# Altium schematic sheet 1_top.SchDoc: =ProjectTitle
size A4; Engineer: 4pplet; Address1: github.com/4pplet/aekiso60; Address2: Licence: CERN-OHL-S; SheetNumber: 1; SheetTotal: 4; ProjectName: waffling60
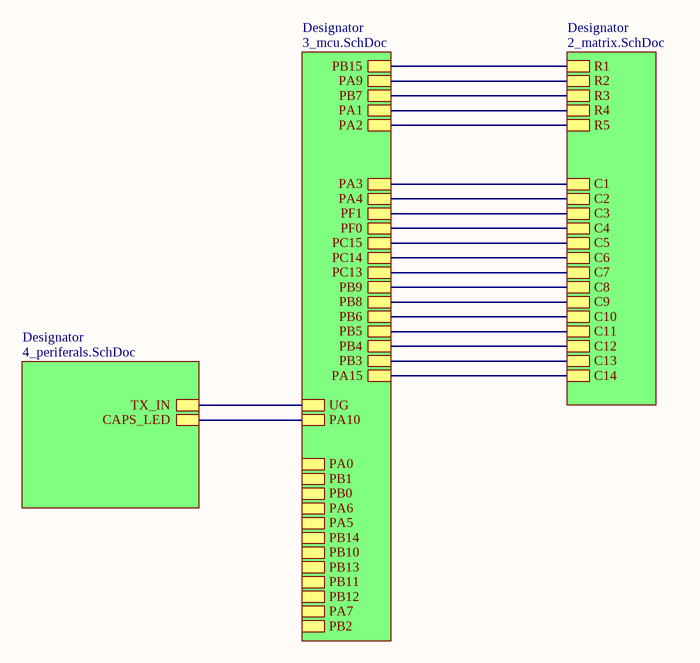
[diagram p0: 1_top.SchDoc]

## Sub-sheets
Designator = 3_mcu.SchDoc: PB8, PA3, PA4, PB11, PB12, PB15, PB13, PB3, PB0, PA9, PA5, PA2, PB7, PB9, PB10, PC14, PA0, PB6, PB2, PB1, PB4, PC15, PA10, PC13, PB14, PA7, PA1, PA6, PA15, PB5, PF1, PF0, UG
Designator = 2_matrix.SchDoc: R5, R4, R3, C1, R1, C2, C14, R2, C12, C3, C4, C5, C6, C7, C8, C9, C10, C11, C13
Designator = 4_periferals.SchDoc: TX_IN, CAPS_LED

## Nets
(unnamed): sheet Designator/PB8, sheet Designator/C9
(unnamed): sheet Designator/PA3, sheet Designator/C1
(unnamed): sheet Designator/PA4, sheet Designator/C2
(unnamed): sheet Designator/PB15, sheet Designator/R1
(unnamed): sheet Designator/PB3, sheet Designator/C13
(unnamed): sheet Designator/PA9, sheet Designator/R2
(unnamed): sheet Designator/PA2, sheet Designator/R5
(unnamed): sheet Designator/PB7, sheet Designator/R3
(unnamed): sheet Designator/PB9, sheet Designator/C8
(unnamed): sheet Designator/PC14, sheet Designator/C6
(unnamed): sheet Designator/PB6, sheet Designator/C10
(unnamed): sheet Designator/PB4, sheet Designator/C12
(unnamed): sheet Designator/PC15, sheet Designator/C5
(unnamed): sheet Designator/PA10, sheet Designator/CAPS_LED
(unnamed): sheet Designator/PC13, sheet Designator/C7
(unnamed): sheet Designator/PA1, sheet Designator/R4
(unnamed): sheet Designator/PA15, sheet Designator/C14
(unnamed): sheet Designator/PB5, sheet Designator/C11
(unnamed): sheet Designator/PF1, sheet Designator/C3
(unnamed): sheet Designator/PF0, sheet Designator/C4
(unnamed): sheet Designator/UG, sheet Designator/TX_IN

## Notes on the sheet
- Title
- Size:
- Date:
- A4
- Number:
- Time:
- Revision:
- Sheet
- of
- File: